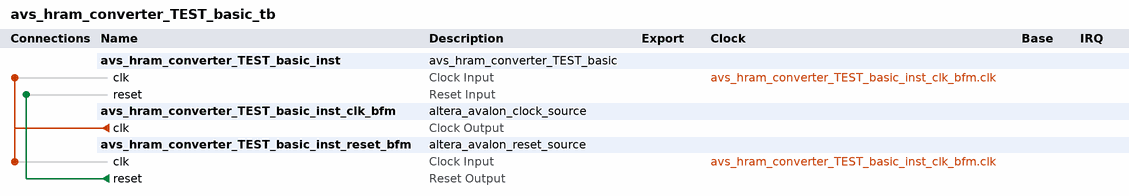
[diagram p0: system contents]
# Platform Designer (Qsys) system avs_hram_converter_TEST_basic_tb, Cyclone 10 LP 10CL006YE144A7G
# Parameters at their usual value, and those the tool derives, are not listed.
package require -exact qsys 22.1
create_system avs_hram_converter_TEST_basic_tb
set_project_property DEVICE_FAMILY {Cyclone 10 LP}
set_project_property DEVICE 10CL006YE144A7G

add_instance avs_hram_converter_TEST_basic_inst avs_hram_converter_TEST_basic 1.0

add_instance avs_hram_converter_TEST_basic_inst_clk_bfm altera_avalon_clock_source 22.1

add_instance avs_hram_converter_TEST_basic_inst_reset_bfm altera_avalon_reset_source 22.1
set_instance_parameter_value avs_hram_converter_TEST_basic_inst_reset_bfm ASSERT_HIGH_RESET 0
set_instance_parameter_value avs_hram_converter_TEST_basic_inst_reset_bfm INITIAL_RESET_CYCLES 50

# connections
add_connection avs_hram_converter_TEST_basic_inst_clk_bfm.clk avs_hram_converter_TEST_basic_inst.clk clock
add_connection avs_hram_converter_TEST_basic_inst_clk_bfm.clk avs_hram_converter_TEST_basic_inst_reset_bfm.clk clock
add_connection avs_hram_converter_TEST_basic_inst_reset_bfm.reset avs_hram_converter_TEST_basic_inst.reset reset

set_interconnect_requirement {$system} qsys_mm.clockCrossingAdapter HANDSHAKE
set_interconnect_requirement {$system} qsys_mm.enableEccProtection FALSE
set_interconnect_requirement {$system} qsys_mm.insertDefaultSlave FALSE
set_interconnect_requirement {$system} qsys_mm.maxAdditionalLatency 1

save_system avs_hram_converter_TEST_basic_tb.qsys
